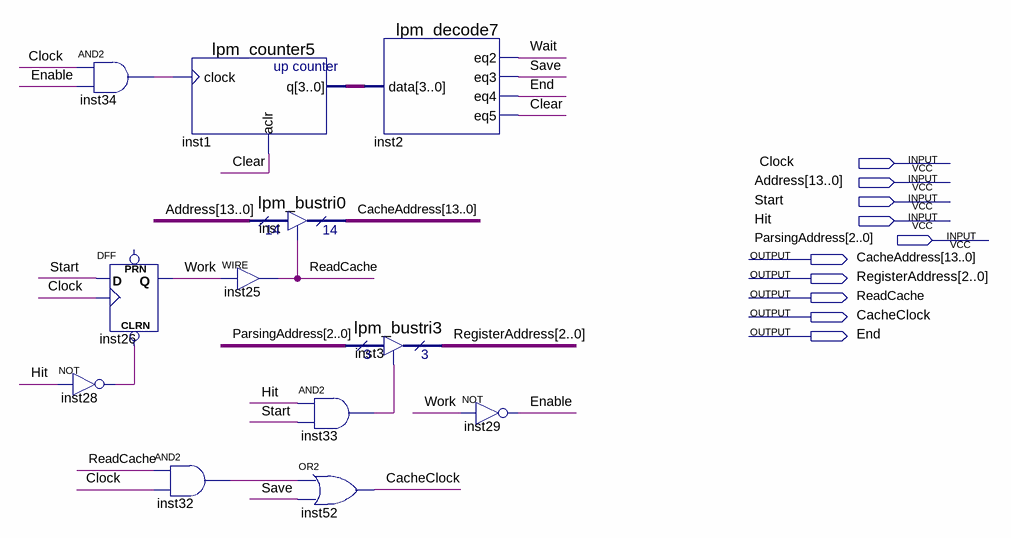
[diagram p0: schematic sheet]
// Quartus schematic MoveRegisterAddress.bdf as structural Verilog: 12 symbols, 10 pins
module MoveRegisterAddress (
  input  Clock,
  input  [13:0] Address,
  input  Start,
  input  Hit,
  input  [2:0] ParsingAddress,
  output [13:0] CacheAddress,
  output [2:0] RegisterAddress,
  output ReadCache,
  output CacheClock,
  output End
);

  wire Clear, Enable, inst28_out, inst32_out, inst33_out, inst34_out, Save, Wait, Work;
  wire [3:0] inst1_q;

  and inst34 (inst34_out, Clock, Enable);
  DFF inst26 (.CLRN(inst28_out), .CLK(Clock), .D(Start), .Q(Work));  // open: PRN
  not inst28 (inst28_out, Hit);
  lpm_counter5 inst1 (.clock(inst34_out), .aclr(Clear), .q(inst1_q));
  and inst32 (inst32_out, ReadCache, Clock);
  lpm_bustri0 inst (.enabledt(ReadCache), .data(Address), .tridata(CacheAddress));
  assign ReadCache = Work;  // WIRE inst25
  lpm_bustri3 inst3 (.enabledt(inst33_out), .data(ParsingAddress), .tridata(RegisterAddress));
  and inst33 (inst33_out, Hit, Start);
  or inst52 (CacheClock, inst32_out, Save);
  lpm_decode7 inst2 (.data(inst1_q), .eq2(Wait), .eq3(Save), .eq4(End), .eq5(Clear));
  not inst29 (Enable, Work);
endmodule
